# Altium schematic sheet Mosfet Driver.SchDoc
size A4; SheetNumber: 1; SheetTotal: 2
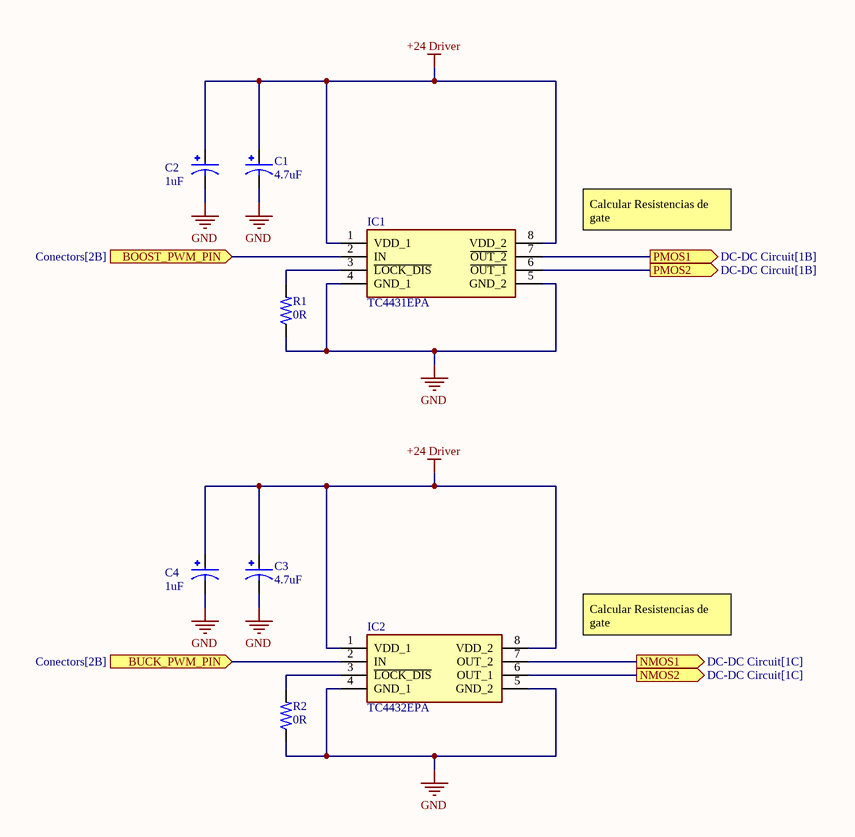
[diagram p0: Mosfet Driver.SchDoc]

## Parts
C1  4.7uF  [Electrolytic 4x5.4]
C2  1uF  [Electrolytic 4x5.4]
C3  4.7uF  [Electrolytic 4x5.4]
C4  1uF  [Electrolytic 4x5.4]
IC1  TC4431EPA  [DIP781W56P254L950H533Q8N]
IC2  TC4432EPA  [DIP781W56P254L950H533Q8N]
R1  0R  [0805]
R2  0R  [0805]

## Ports
BOOST_PWM_PIN (in, see Conectors[2B]), BUCK_PWM_PIN (in, see Conectors[2B]), NMOS1 (out, see DC-DC Circuit[1C]), NMOS2 (out, see DC-DC Circuit[1C]), PMOS1 (out, see DC-DC Circuit[1B]), PMOS2 (out, see DC-DC Circuit[1B])

## Nets
+24 Driver: C1.1 C2.1 C3.1 C4.1 IC1.1(VDD_1) IC1.8(VDD_2) IC2.1(VDD_1) IC2.8(VDD_2)
GND: C1.2 C2.2 C3.2 C4.2 IC1.4(GND_1) IC1.5(GND_2) IC2.4(GND_1) IC2.5(GND_2) R1.1 R2.1
BOOST_PWM_PIN: IC1.2(IN) ; port BOOST_PWM_PIN
BUCK_PWM_PIN: IC2.2(IN) ; port BUCK_PWM_PIN
NMOS1: IC2.7(OUT_2) ; port NMOS1
NMOS2: IC2.6(OUT_1) ; port NMOS2
PMOS1: IC1.7(~{OUT_2}) ; port PMOS1
PMOS2: IC1.6(~{OUT_1}) ; port PMOS2
NetIC1_3: IC1.3(~{LOCK_DIS}) R1.2
NetIC2_3: IC2.3(~{LOCK_DIS}) R2.2

## Notes on the sheet
- Calcular Resistencias de gate

## Library data of the parts
C1-C4 = Electrolytic 4x5.4: MF: Panasonic; MP: EEE-HA1E100WR; Package: RADIAL-2 Panasonic; Check_prices: https://www.snapeda.com/parts/EEE-HA1E100WR/Panasonic/view-part/778519/?ref=eda; Value: *; Price: None; Purchase-URL: https://pricing.snapeda.com/search/part/EEE-HA1E100WR/?ref=eda; SnapEDA_Link: https://www.snapeda.com/parts/EEE-HA1E100WR/Panasonic/view-part/778519/?ref=snap; Availability: In Stock
IC1 = TC4431EPA: Integrated Circuit; Manufacturer_Name: Microchip; Datasheet Link: http://www.microchip.com/mymicrochip/filehandler.aspx?ddocname=en011707; Height: 5.334mm; Manufacturer_Part_Number: TC4431EPA; Mouser Part Number: 579-TC4431EPA; Mouser Price/Stock: https://www.mouser.co.uk/ProductDetail/Microchip-Technology/TC4431EPA?qs=6NittM2kKvToa0NDydYeNA%3D%3D; Arrow Part Number: TC4431EPA; Arrow Price/Stock: https://www.arrow.com/en/products/tc4431epa/microchip-technology
IC2 = TC4432EPA: Integrated Circuit; Manufacturer_Name: Microchip; Datasheet Link: http://ww1.microchip.com/downloads/en/DeviceDoc/21424d.pdf; Height: 5.334mm; Manufacturer_Part_Number: TC4432EPA; Mouser Part Number: 579-TC4432EPA; Mouser Price/Stock: https://www.mouser.co.uk/ProductDetail/Microchip-Technology-Atmel/TC4432EPA?qs=EkZBwCRGcSv79fL5L3lP6g%3D%3D; Arrow Part Number: TC4432EPA; Arrow Price/Stock: https://www.arrow.com/en/products/tc4432epa/microchip-technology
R1 R2 = 0805_Resistor: Power_Rating: .25 W; MP: 2-2176053-0; Tolerance: 1%; Resistance: .33; MF: TE Connectivity; Price: None; Availability: In Stock; EU_RoHS_Compliance: Compliant with Exemptions; Package: 0805; Value: *; SnapEDA_Link: https://www.snapeda.com/parts/2-2176053-0/TE+Connectivity/view-part/?ref=snap; Check_prices: https://www.snapeda.com/parts/2-2176053-0/TE+Connectivity/view-part/?ref=eda